# EAGLE design TheSmartTenDollarJobKaufmanSpaceBig (EAGLE 6.4)
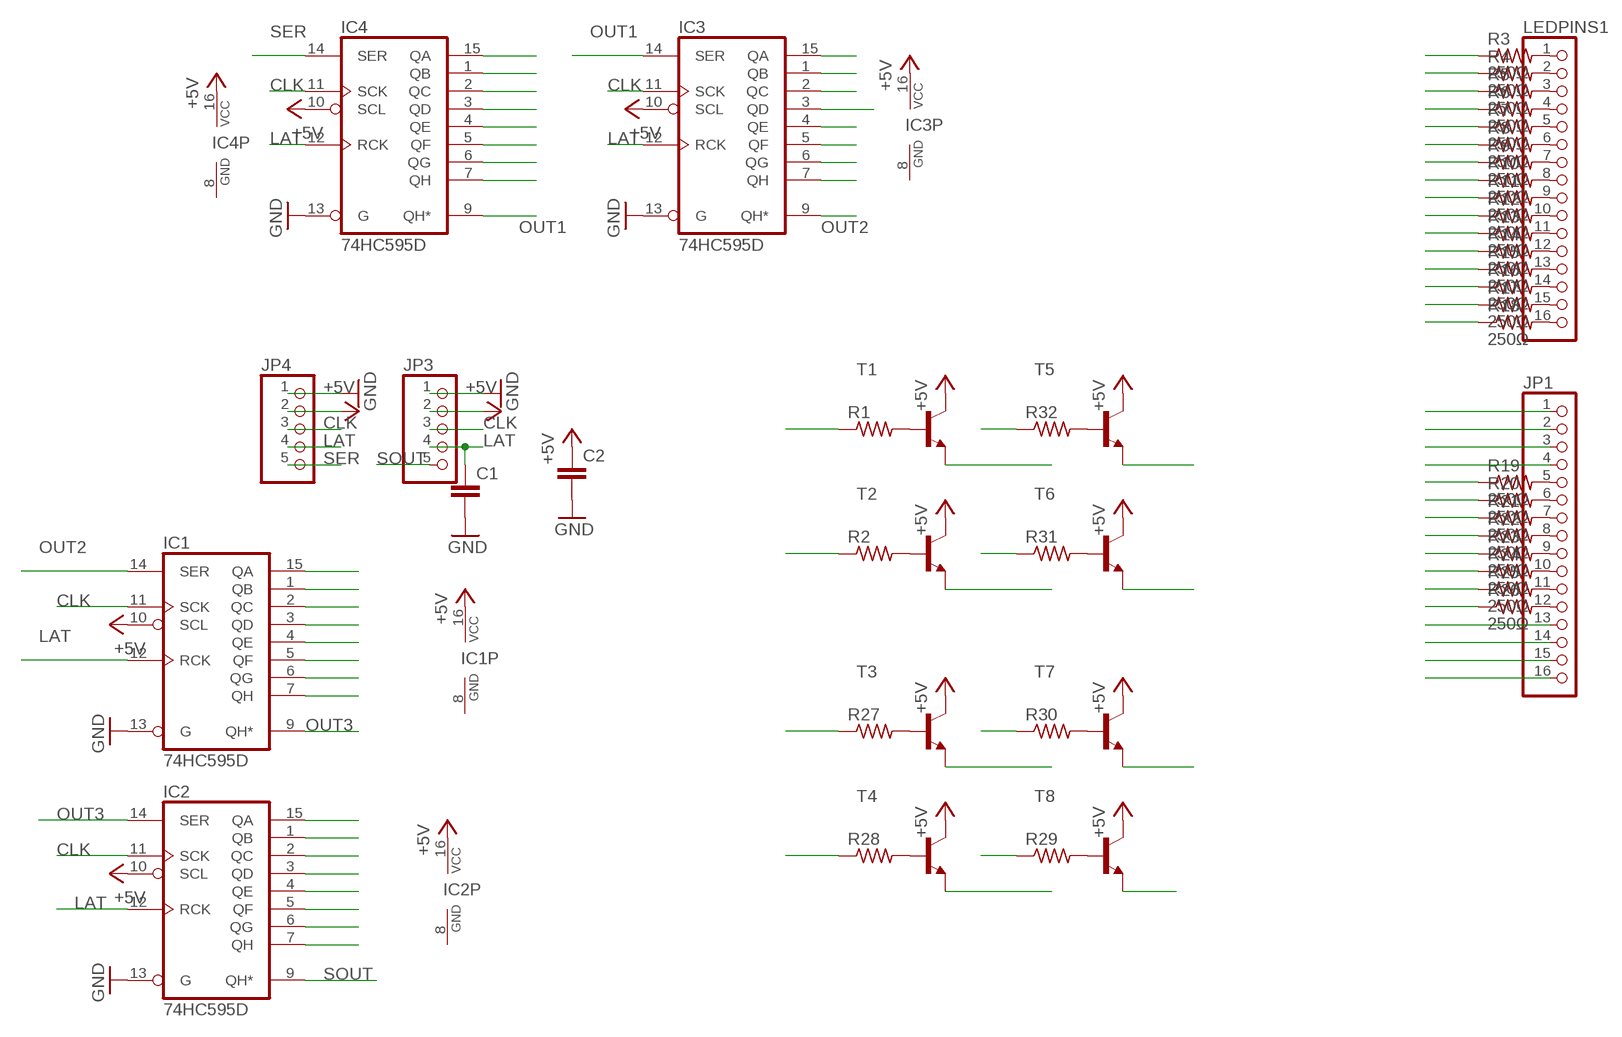
[diagram p0: schematic, sheet 1]

## Parts
C1  C-EUC0603  [C0603]
C2  C-EUC0603  [C0603]
IC1  74HC595D  [SO16]
IC2  74HC595D  [SO16]
IC3  74HC595D  [SO16]
IC4  74HC595D  [SO16]
JP1  PINHD-1X16  [1X16]
JP3  PINHD-1X5  [1X05]
JP4  PINHD-1X5  [1X05]
LEDPINS1  PINHD-1X16  [1X16]
R1  R-US_R0603  [R0603]
R2  R-US_R0603  [R0603]
R3  250Ω  R-US_R0603  [R0603]
R4  250Ω  R-US_R0603  [R0603]
R5  250Ω  R-US_R0603  [R0603]
R6  250Ω  R-US_R0603  [R0603]
R7  250Ω  R-US_R0603  [R0603]
R8  250Ω  R-US_R0603  [R0603]
R9  250Ω  R-US_R0603  [R0603]
R10  250Ω  R-US_R0603  [R0603]
R11  250Ω  R-US_R0603  [R0603]
R12  250Ω  R-US_R0603  [R0603]
R13  250Ω  R-US_R0603  [R0603]
R14  250Ω  R-US_R0603  [R0603]
R15  250Ω  R-US_R0603  [R0603]
R16  250Ω  R-US_R0603  [R0603]
R17  250Ω  R-US_R0603  [R0603]
R18  250Ω  R-US_R0603  [R0603]
R19  250Ω  R-US_R0603  [R0603]
R20  250Ω  R-US_R0603  [R0603]
R21  250Ω  R-US_R0603  [R0603]
R22  250Ω  R-US_R0603  [R0603]
R23  250Ω  R-US_R0603  [R0603]
R24  250Ω  R-US_R0603  [R0603]
R25  250Ω  R-US_R0603  [R0603]
R26  250Ω  R-US_R0603  [R0603]
R27  R-US_R0603  [R0603]
R28  R-US_R0603  [R0603]
R29  R-US_R0603  [R0603]
R30  R-US_R0603  [R0603]
R31  R-US_R0603  [R0603]
R32  R-US_R0603  [R0603]
T1  -NPN-SOT23-EBC  [SOT23-EBC]
T2  -NPN-SOT23-EBC  [SOT23-EBC]
T3  -NPN-SOT23-EBC  [SOT23-EBC]
T4  -NPN-SOT23-EBC  [SOT23-EBC]
T5  -NPN-SOT23-EBC  [SOT23-EBC]
T6  -NPN-SOT23-EBC  [SOT23-EBC]
T7  -NPN-SOT23-EBC  [SOT23-EBC]
T8  -NPN-SOT23-EBC  [SOT23-EBC]

## Nets
+5V: C2.1 IC1.10(SCL) IC1.16(VCC) IC2.10(SCL) IC2.16(VCC) IC3.10(SCL) IC3.16(VCC) IC4.10(SCL) IC4.16(VCC) JP3.2 JP4.2 T1.C T2.C T3.C T4.C T5.C T6.C T7.C T8.C
CLK: IC1.11(SCK) IC2.11(SCK) IC3.11(SCK) IC4.11(SCK) JP3.3 JP4.3
GND: C1.2 C2.2 IC1.13(G) IC2.13(G) IC3.13(G) IC4.13(G) JP3.1 JP4.1
LAT: C1.1 IC1.12(RCK) IC2.12(RCK) IC3.12(RCK) IC4.12(RCK) JP3.4 JP4.4
N$1: IC3.15(QA) R3.1
N$2: IC3.7(QH) R4.1
N$3: IC3.6(QG) R5.1
N$4: IC3.5(QF) R6.1
N$5: IC3.4(QE) R7.1
N$6: IC3.3(QD) R8.1
N$7: IC3.2(QC) R9.1
N$8: IC3.1(QB) R10.1
N$9: IC4.7(QH) R11.1
N$10: IC4.6(QG) R12.1
N$11: IC4.5(QF) R13.1
N$12: IC4.4(QE) R14.1
N$13: IC4.3(QD) R15.1
N$14: IC4.2(QC) R16.1
N$15: IC4.1(QB) R17.1
N$16: IC4.15(QA) R18.1
N$17: JP1.1 T1.E
N$18: JP1.2 T2.E
N$19: JP1.3 T3.E
N$20: JP1.4 T4.E
N$21: IC1.4(QE) R19.1
N$22: IC1.5(QF) R20.1
N$23: IC1.6(QG) R21.1
N$24: IC1.7(QH) R22.1
N$25: IC2.1(QB) R23.1
N$26: IC2.2(QC) R24.1
N$27: IC2.3(QD) R25.1
N$28: IC2.4(QE) R26.1
N$29: JP1.13 T5.E
N$30: JP1.14 T6.E
N$31: JP1.15 T7.E
N$32: JP1.16 T8.E
N$33: LEDPINS1.1 R3.2
N$34: R1.2 T1.B
N$35: LEDPINS1.2 R4.2
N$36: LEDPINS1.3 R5.2
N$37: LEDPINS1.4 R6.2
N$38: LEDPINS1.5 R7.2
N$39: LEDPINS1.6 R8.2
N$40: LEDPINS1.7 R9.2
N$41: LEDPINS1.8 R10.2
N$42: LEDPINS1.9 R11.2
N$43: LEDPINS1.10 R12.2
N$44: LEDPINS1.11 R13.2
N$45: LEDPINS1.12 R14.2
N$46: LEDPINS1.13 R15.2
N$47: LEDPINS1.14 R16.2
N$48: LEDPINS1.15 R17.2
N$49: LEDPINS1.16 R18.2
N$50: JP1.5 R19.2
N$51: JP1.6 R20.2
N$52: JP1.7 R21.2
N$53: JP1.8 R22.2
N$54: JP1.9 R23.2
N$55: JP1.10 R24.2
N$56: JP1.11 R25.2
N$57: JP1.12 R26.2
N$58: R2.2 T2.B
N$59: R27.2 T3.B
N$60: R28.2 T4.B
N$61: R29.2 T8.B
N$62: R30.2 T7.B
N$63: R31.2 T6.B
N$64: R32.2 T5.B
OUT1: IC3.14(SER) IC4.9(QH*)
OUT2: IC1.14(SER) IC3.9(QH*)
OUT3: IC1.9(QH*) IC2.14(SER)
QA: IC1.15(QA) R1.1
QB: IC1.1(QB) R2.1
QC: IC1.2(QC) R27.1
QD: IC1.3(QD) R28.1
QE: IC2.5(QF) R32.1
QF: IC2.6(QG) R31.1
QG: IC2.7(QH) R30.1
QH: IC2.15(QA) R29.1
SER: IC4.14(SER) JP4.5
SOUT: IC2.9(QH*) JP3.5

## Power pins joined to a net without a drawn wire
GND: IC1.8(GND) IC2.8(GND) IC3.8(GND) IC4.8(GND)

## Library data of the parts
C1 C2 = rcl:C-EU: CAPACITOR, European symbol
IC1-IC4 = 74xx-eu:74*595: 8-bit SHIFT REGISTER, output latch
JP1 LEDPINS1 = pinhead:PINHD-1X16: PIN HEADER
JP3 JP4 = pinhead:PINHD-1X5: PIN HEADER
R1 R2 R27-R32 = resistor:R-US_: RESISTOR, American symbol
R3-R26 = rcl:R-US_: RESISTOR, American symbol
T1-T8 = transistor:*-NPN-: NPN Transistror BF959 corrected 2008.03.06

## Board
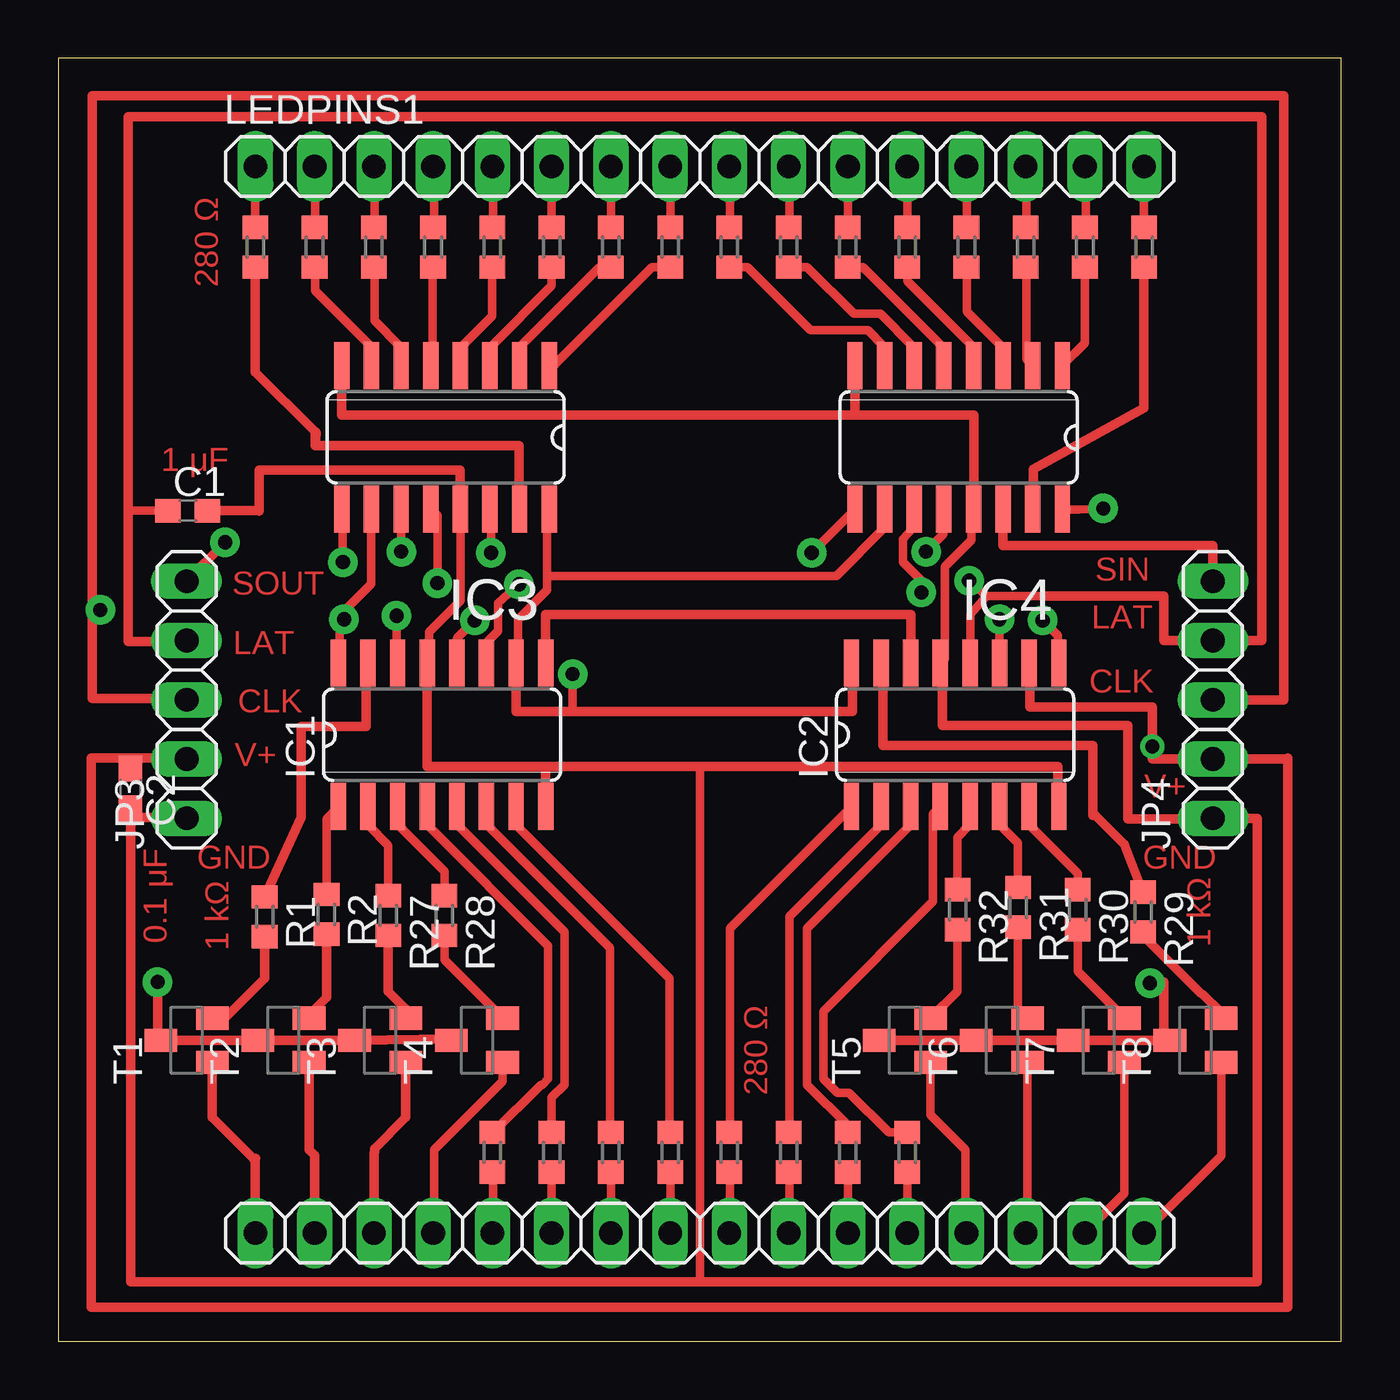
[diagram p1: board, top side]
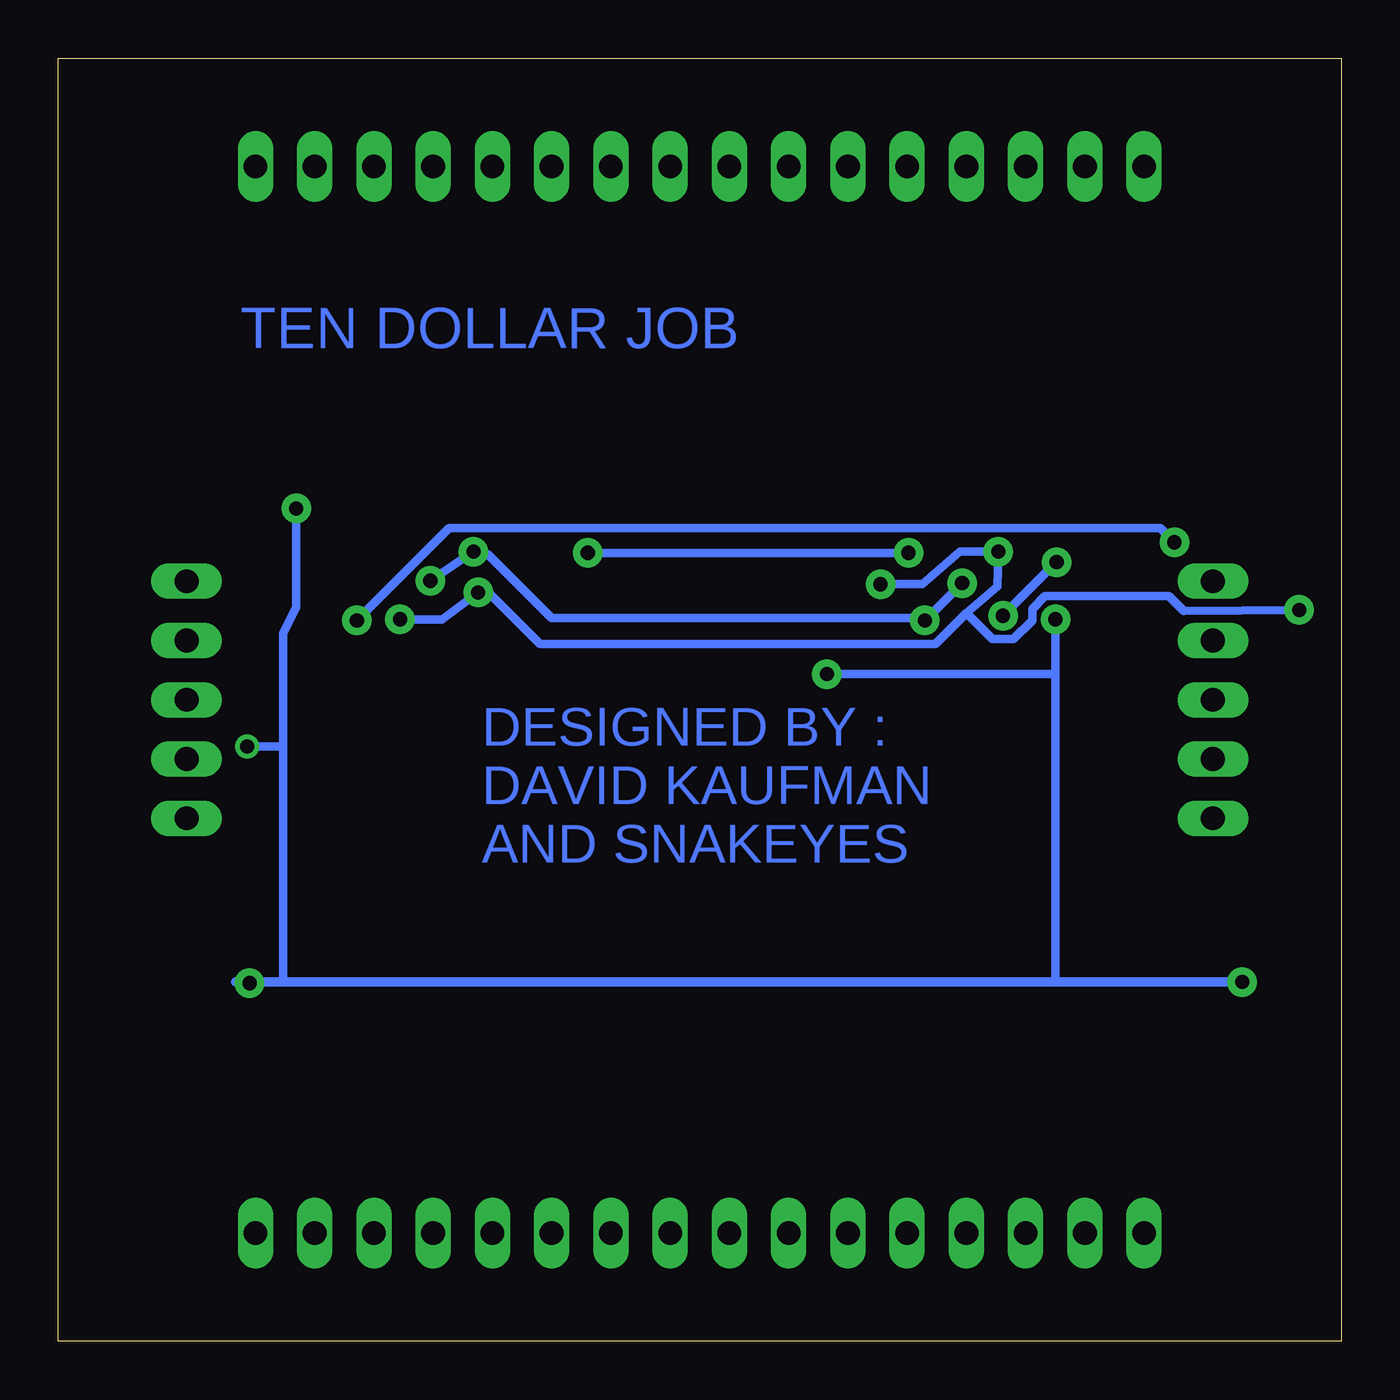
[diagram p2: board, bottom side, seen from below]

Size 55 x 55 mm. Coordinates in mm from the lower left corner, seen from the top.
Outline: 0,0 55,0 55,55 0,55 0,0
Copper layers (1*16): Top 0.035mm / dielectric 1.5mm / Bottom 0.035mm
Design rules "miters": minimum track width 14mil, minimum drill 24mil, track to track 12mil, track to pad 12mil, pad to pad 12mil, via to via 12mil, smd to smd 12mil, copper to edge 40mil, drill to drill 8mil, minimum pad ring 10mil, minimum via ring 8mil, stop-mask expansion 4mil, vias tented up to drill 0mil, thermal gap 10mil
tKeepout: area 11.6,36.8 to 21.6,40.8; area 33.6,36.8 to 43.6,40.8; area 11.4,24 to 21.4,28; area 33.5,24 to 43.5,28; area 6.1,11.4 to 7.1,14.4; area 10.7,11.4 to 11.7,14.4; area 15.2,11.4 to 16.2,14.4; area 19.6,11.4 to 20.6,14.4; area 34.6,11.5 to 35.6,14.5; area 39,11.6 to 40,14.6; area 43.5,11.5 to 44.5,14.5; area 47.9,11.5 to 48.9,14.5
bKeepout: area 4.1,31.9 to 6.8,33.3; area 4.1,26.8 to 6.9,28.3; area 4.2,24.3 to 6.8,25.6; area 48.1,26.8 to 51,28.2; area 48.1,24.4 to 50.8,25.7
tRestrict: area 11.6,36.8 to 21.6,40.8; area 33.6,36.8 to 43.6,40.8; area 11.4,24 to 21.4,28; area 33.5,24 to 43.5,28; area 6.1,11.4 to 7.1,14.4; area 10.7,11.4 to 11.7,14.4; area 15.2,11.4 to 16.2,14.4; area 19.6,11.4 to 20.6,14.4; area 34.6,11.5 to 35.6,14.5; area 39,11.6 to 40,14.6; area 43.5,11.5 to 44.5,14.5; area 47.9,11.5 to 48.9,14.5
bRestrict: area 4,31.9 to 6.8,33.4; area 4,26.7 to 7,28.4; area 4.1,24.2 to 6.9,25.6; area 47.9,24.3 to 50.9,25.8; area 48,26.8 to 50.9,28.2

### Footprints (pad centres in the part's own frame; a part is rotated, then mirrored left to right if it is on the bottom)
C0603 = smd 1.1 x 1: 1 -0.85,0; 2 0.85,0
SO16 = smd 0.66 x 2.032: 1 -4.445,-3.073; 2 -3.175,-3.073; 3 -1.905,-3.073; 4 -0.635,-3.073; 5 0.635,-3.073; 6 1.905,-3.073; 7 3.175,-3.073; 8 4.445,-3.073; 9 4.445,3.073; 10 3.175,3.073; 11 1.905,3.073; 12 0.635,3.073; 13 -0.635,3.073; 14 -1.905,3.073; 15 -3.175,3.073; 16 -4.445,3.073
1X16 = drill 1.016 long: 1 -19.05,0; 2 -16.51,0; 3 -13.97,0; 4 -11.43,0; 5 -8.89,0; 6 -6.35,0; 7 -3.81,0; 8 -1.27,0; 9 1.27,0; 10 3.81,0; 11 6.35,0; 12 8.89,0; 13 11.43,0; 14 13.97,0; 15 16.51,0; 16 19.05,0
1X05 = drill 1.016 long: 1 -5.08,0; 2 -2.54,0; 3 0,0; 4 2.54,0; 5 5.08,0
R0603 = smd 1 x 1.1: 1 -0.85,0; 2 0.85,0
SOT23-EBC = smd 1 x 1.4: B 0.95,-1.1; C 0,1.1; E -0.95,-1.1

### Placement (x,y rotation side)
C1  5.55,35.6 0 top
C2  3.1,23.7 270 top
IC1  16.45,26 0 top
IC2  38.45,26 0 top
IC3  16.6,38.75 180 top
IC4  38.6,38.75 180 top
JP1  27.5,4.64 0 top
JP3  5.5,27.5 90 top
JP4  49.5,27.5 90 top
LEDPINS1  27.5,50.36 0 top
R1  8.85,18.2 270 top
R2  11.5,18.3 270 top
R3  8.45,46.9 90 top
R4  10.99,46.9 90 top
R5  13.53,46.9 90 top
R6  16.07,46.9 90 top
R7  18.61,46.9 90 top
R8  21.15,46.9 90 top
R9  23.69,46.9 90 top
R10  26.23,46.9 90 top
R11  28.77,46.9 90 top
R12  31.31,46.9 90 top
R13  33.85,46.9 90 top
R14  36.39,46.9 90 top
R15  38.93,46.9 90 top
R16  41.47,46.9 90 top
R17  44.01,46.9 90 top
R18  46.55,46.9 90 top
R19  18.61,8.1 270 top
R20  21.15,8.1 270 top
R21  23.69,8.1 270 top
R22  26.23,8.1 270 top
R23  28.77,8.1 270 top
R24  31.31,8.1 270 top
R25  33.85,8.1 270 top
R26  36.39,8.1 270 top
R27  14.15,18.25 270 top
R28  16.55,18.25 270 top
R29  46.5,18.4 270 top
R30  43.7,18.5 270 top
R31  41.15,18.6 270 top
R32  38.55,18.5 270 top
T1  5.5,12.9 90 top
T2  9.65,12.9 90 top
T3  13.8,12.9 90 top
T4  17.95,12.9 90 top
T5  36.3,12.9 90 top
T6  40.45,12.9 90 top
T7  44.6,12.9 90 top
T8  48.75,12.9 90 top

### Tracks (layer width: path | path; a pad name or v marks a point on that pad's centre or on a via)
+5V  (via drill 0.6 pad 1.27, 0.61, 0.61 pad 1.27)
  Top 0.356: 20.95,32.8 20.95,32.2 19.7,30.95 19.7,29.25 IC1.10 | 20.95,32.8 20.95,35.5 IC3.16 | JP3.2 5.5,25 | 47.4,13.1 T8.C | 20.95,32.8 33.35,32.8 35.4,34.85 35.4,35.65 IC4.10 | 12.05,30.95 12.05,31.1 13.4,32.45 13.4,35.65 IC3.10 | 12.05,30.95 12.05,29.1 IC1.16 | v44.8,35.7 43.75,35.65 43.05,35.65 IC4.16 | v12.25,30.95 12.05,30.95 | v22.05,28.6 22.05,27
  Top 0.406: 52.7,24.96 JP4.2 46.9,24.95 v46.9,25.5 46.9,27.2 41.65,27.2 41.65,29.07 IC2.10 | 52.7,24.96 52.7,25 | 52.7,24.96 52.7,1.45 1.4,1.45 1.4,25 3.2,25 | 3.2,25 5.5,25 | C2.1 3.2,24.55 3.2,25 | IC2.16 34.05,29.07 34.05,27 22.05,27 19.62,27 IC1.10 | T4.C 16.85,12.95 T3.C T2.C T1.C 4.25,12.9 | T5.C T6.C T7.C T8.C | 4.15,12.9 4.25,12.9 | 4.25,12.9 v4.25,15.4 | 47.4,13.1 47.4,15.4 46.8,15.4 v46.8,15.35
  Bottom 0.356: JP4.2 49.35,24.85 | v44.8,35.7 44.8,31.45 45.35,30.35 45.35,25.5 | 45.35,15.4 45.35,25.5 | 12.25,15.4 12.25,28.6 | 12.25,28.6 v12.25,30.95 | 12.25,28.6 v22.05,28.6 | v46.9,25.5 45.35,25.5
  Bottom 0.406: v4.25,15.4 12.25,15.4 45.35,15.4 47.4,15.4 v46.8,15.35
CLK  (via drill 0.61 pad 1.27)
  Top 0.356: v19.75,32.45 18.85,31.65 18.85,30.45 18.4,30 18.4,29.1 IC1.11 | v14.7,33.85 14.7,35.65 IC3.11 | v40.35,30.95 40.35,29.1 IC2.11 | v37,32.1 37,32.6 36.2,33.4 36.2,34.4 36.65,34.85 36.65,35.65 IC4.11 | 1.45,31.3 v1.8,31.35
  Top 0.406: JP4.3 52.55,27.5 52.55,53.4 1.45,53.4 1.45,31.3 1.45,27.55 5.5,27.55 JP3.3
  Bottom 0.356: v19.75,32.45 17.95,32.45 16.35,33.85 v14.7,33.85 14.75,32.35 16.07,31.23 | v40.35,30.95 38.55,30.95 v37,32.1 36.85,32.4 34.35,29.9 17.4,29.9 16.07,31.23 | 16.07,31.23 14.95,30.1 14.05,30.1 13.25,30.9 13.25,31.4 12.7,31.95 7.4,31.95 6.75,31.3 v1.8,31.35
GND
  Top 0.356: IC3.13 17.25,35.5 17.25,31.75 15.9,30.4 15.9,29.25 IC1.13 | 5.5,22.4 JP3.1 5.5,22.45 | IC2.13 38,29.25 38,33.2 39.15,34.35 39.15,35.5 IC4.13 | 27.5,2.55 27.5,24.65
  Top 0.406: IC4.8 34.15,39.7 | 34.15,39.7 39.25,39.7 39.25,36.6 39.23,36.6 IC4.13 | 3.1,22.45 3.1,2.55 27.5,2.55 51.4,2.55 51.4,22.42 JP4.1 49.5,22.4 45.85,22.4 45.85,26.4 37.9,26.4 37.9,29.07 IC2.13 | 3.1,22.45 5.5,22.45 | IC2.8 42.85,22.93 42.85,24.65 27.5,24.65 20.89,24.65 | 20.89,24.65 IC1.8 | IC1.13 15.8,24.65 20.89,24.65 | C2.2 3.1,22.45 | C1.2 8.6,35.6 8.6,37.35 17.23,37.35 IC3.13 | IC3.8 12.15,39.7 34.15,39.7
LAT  (via drill 0.61 pad 1.27)
  Top 0.356: v17.85,30.9 17.1,30.15 17.1,29.1 IC1.12 | v16.25,32.5 16.25,35.4 16,35.65 IC3.12 | 3,35.6 C1.1 | 39.8,31.95 42.25,31.95 | 39.8,31.95 39.1,31.15 39.1,29.1 IC2.12 | 49.3,30.1 JP4.4 | v37.2,33.85 37.95,34.6 37.95,35.65 IC4.12 | 39.8,31.95 v39.05,32.6
  Top 0.406: JP3.4 5.5,30 3,30 3,35.6 3,52.5 51.6,52.5 51.6,30.04 JP4.4 47.4,30.05 47.4,31.95 42.25,31.95
  Bottom 0.356: v16.25,32.5 v17.85,30.9 18,31 33.85,31 36.6,33.75 37.05,33.75 v37.2,33.85 v39.05,32.6
N$1
  Top 0.406: IC3.15 19.75,35.68 19.75,38.4 11,38.4 | 11,38.4 11.05,38.95 | 11,38.4 11,39 8.45,41.55 R3.1
N$2
  Top 0.356: R4.1 11,45.05 13.4,42.65 13.4,41.85 IC3.7
N$3
  Top 0.356: R5.1 13.55,46.05 13.55,43.75 14.65,42.65 14.65,41.85 IC3.6
N$4
  Top 0.356: R6.1 16.05,46.05 16.05,41.9 16,41.85 IC3.5
N$5
  Top 0.356: R7.1 18.6,43.95 17.25,42.6 17.25,41.85 IC3.4
N$6
  Top 0.356: R8.1 21.15,45.25 18.55,42.65 18.55,41.85 IC3.3
N$7
  Top 0.356: R9.1 23.2,46.05 19.8,42.65 19.8,41.85 IC3.2
N$8
  Top 0.356: R10.1 25.45,46.05 21.25,41.85 21.05,41.85 IC3.1
N$9
  Top 0.356: R11.1 29.55,46.05 32.25,43.35 34.7,43.35 35.4,42.65 35.4,41.85 IC4.7
N$10
  Top 0.356: R12.1 32.1,46.05 34.1,44.05 35.25,44.05 36.65,42.65 36.65,41.85 IC4.6
N$11
  Top 0.356: R13.1 34.5,46.05 37.95,42.6 37.95,41.85 IC4.5
N$12
  Top 0.356: R14.1 36.4,45.45 39.2,42.65 39.2,41.85 IC4.4
N$13
  Top 0.356: R15.1 38.95,46.05 38.95,44.15 40.5,42.6 40.5,41.85 IC4.3
N$14
  Top 0.356: R16.1 41.5,46.05 41.5,42.1 41.75,41.85 IC4.2
N$15
  Top 0.356: R17.1 44,42.8 43.05,41.85 IC4.1
N$16
  Top 0.406: IC4.15 41.8,35.68 41.8,37.4 46.55,40 R18.1
N$17
  Top 0.406: JP1.1 8.45,7.85 8.35,7.85 6.6,9.6 T1.E
N$18
  Top 0.406: JP1.2 10.99,7.96 10.75,8.2 T2.E
N$19
  Top 0.406: JP1.3 13.53,8.08 13.55,8.1 13.55,8.25 14.9,9.6 T3.E
N$20
  Top 0.356: T4.E 19.05,11.15 16.1,8.2 16.1,4.65 JP1.4
N$21
  Top 0.356: R19.1 18.65,8.95 20.7,11 20.75,11 21,11.25 21,16.95 15.85,22.1 15.85,22.9 IC1.4
N$22
  Top 0.356: R20.1 21.15,10.45 21.7,11 21.7,17.55 17.1,22.15 17.1,22.9 IC1.5
N$23
  Top 0.356: R21.1 23.65,8.95 23.65,16.85 18.4,22.1 18.4,22.9 IC1.6
N$24
  Top 0.356: R22.1 26.2,8.95 26.2,15.55 19.65,22.1 19.65,22.9 IC1.7
N$25
  Top 0.356: R23.1 28.8,8.95 28.8,17.7 34,22.9 IC2.1
N$26
  Top 0.356: R24.1 31.35,8.95 31.35,18.2 35.25,22.1 35.25,22.9 IC2.2
N$27
  Top 0.356: R25.1 33.85,9.25 32.1,11 32.1,17.7 36.5,22.1 36.5,22.9 IC2.3
N$28
  Top 0.356: R26.1 35.6,8.95 33.9,10.65 33.4,10.65 32.8,11.25 32.8,14.15 37.5,18.85 37.5,22.6 37.8,22.9 IC2.4
N$29
  Top 0.356: T5.E 37.4,9.7 38.9,8.2 38.9,4.65 JP1.13
N$30
  Top 0.356: T6.E 41.55,4.7 41.5,4.65 JP1.14
N$31
  Top 0.356: T7.E 45.7,6.35 JP1.15
N$32
  Top 0.356: T8.E 49.85,7.95 JP1.16
N$33
  Top 0.356: LEDPINS1.1 R3.2
N$34
  Top 0.406: T1.B 7.15,13.85 8.85,15.55 R1.2
N$35
  Top 0.356: R4.2 LEDPINS1.2
N$36
  Top 0.356: R5.2 13.55,47.75 13.55,50.35 LEDPINS1.3
N$37
  Top 0.356: R6.2 16.1,47.75 16.1,50.35 LEDPINS1.4
N$38
  Top 0.356: R7.2 18.65,47.75 18.65,50.35 LEDPINS1.5
N$39
  Top 0.356: LEDPINS1.6 R8.2
N$40
  Top 0.356: R9.2 LEDPINS1.7
N$41
  Top 0.356: R10.2 26.25,47.75 26.25,50.35 LEDPINS1.8
N$42
  Top 0.356: R11.2 28.8,47.75 28.8,50.35 LEDPINS1.9
N$43
  Top 0.356: R12.2 31.35,47.75 31.35,50.35 LEDPINS1.10
N$44
  Top 0.356: LEDPINS1.11 R13.2
N$45
  Top 0.356: R14.2 LEDPINS1.12
N$46
  Top 0.356: R15.2 38.95,47.75 38.95,50.35 LEDPINS1.13
N$47
  Top 0.356: R16.2 41.5,47.75 41.5,50.35 LEDPINS1.14
N$48
  Top 0.356: R17.2 44.05,47.75 44.05,50.35 LEDPINS1.15
N$49
  Top 0.356: LEDPINS1.16 R18.2
N$50
  Top 0.356: R19.2 18.65,7.25 18.65,4.65 JP1.5
N$51
  Top 0.356: JP1.6 R20.2
N$52
  Top 0.356: R21.2 JP1.7
N$53
  Top 0.356: R22.2 26.25,7.25 26.25,4.65 JP1.8
N$54
  Top 0.356: R23.2 28.8,7.25 28.8,4.65 JP1.9
N$55
  Top 0.356: R24.2 31.35,7.25 31.35,4.65 JP1.10
N$56
  Top 0.356: JP1.11 R25.2
N$57
  Top 0.356: R26.2 JP1.12
N$58
  Top 0.406: T2.B 10.75,14 11.5,14.75 R2.2
N$59
  Top 0.406: T3.B 14.9,14.25 14.15,15 R27.2
N$60
  Top 0.356: R28.2 16.55,16.35 T4.B
N$61
  Top 0.356: R29.2 46.5,17.4 49,14.9 49.05,14.9 49.85,14.1 T8.B
N$62
  Top 0.356: R30.2 43.7,15.85 T7.B
N$63
  Top 0.356: R31.2 41.15,14.25 T6.B
N$64
  Top 0.356: R32.2 38.55,15 T5.B
OUT1  (via drill 0.61 pad 1.27)
  Top 0.356: v18.55,33.8 18.55,35.65 IC3.14 | v32.3,33.8 34.15,35.65 IC4.9
  Bottom 0.356: v32.3,33.8 v18.55,33.8
OUT2  (via drill 0.61 pad 1.27)
  Top 0.356: v14.5,31.1 14.5,29.1 IC1.14 | v12.2,33.4 12.2,35.65 IC3.9
  Bottom 0.356: v12.2,33.4 v14.5,31.1
OUT3
  Top 0.406: IC1.9 20.89,30.39 20.9,31.15 36.55,31.15 IC2.14
QA
  Top 0.406: IC1.15 13.2,29.07 13.2,26.35 10.4,26.35 10.4,22.45 R1.1
QB
  Top 0.356: R2.1 11.5,22.4 12,22.9 IC1.1
QC
  Top 0.356: R27.1 14.15,21.25 13.3,22.1 13.3,22.9 IC1.2
QD
  Top 0.356: R28.1 16.55,20.15 14.55,22.15 14.55,22.9 IC1.3
QE
  Top 0.356: R32.1 38.55,21.6 39.05,22.1 39.05,22.9 IC2.5
QF
  Top 0.356: R31.1 41.15,21.35 40.4,22.1 40.4,22.9 IC2.6
QG
  Top 0.356: R30.1 43.7,20.05 41.65,22.1 41.65,22.9 IC2.7
QH
  Top 0.406: IC2.15 35.35,29.07 35.35,25.55 44.35,25.55 44.35,22.55 44.45,22.55 45.7,21.3 R29.1
SER
  Top 0.356: 40.55,34.85 40.55,35.65 IC4.14 | 49.5,32.6 JP4.5
  Top 0.406: 40.55,34.85 40.5,34.85 40.5,34.1 49.5,34.1 JP4.5
SOUT  (via drill 0.61 pad 1.27)
  Top 0.356: v42.2,30.9 42.85,30.25 42.85,29.1 IC2.9 | v7.15,34.25 5.5,32.6 JP3.5
  Bottom 0.356: v42.2,30.9 38.25,34.85 7.75,34.85 v7.15,34.25

### Text on the board
Top: 280 Ω | 1 μF | SIN | SOUT | LAT | LAT | CLK | CLK | V+ | V+ | GND | GND | 0.1 μF | 1 kΩ | 1 kΩ | 280 Ω
Bottom: TEN DOLLAR JOB | DESIGNED BY : / DAVID KAUFMAN / AND SNAKEYES